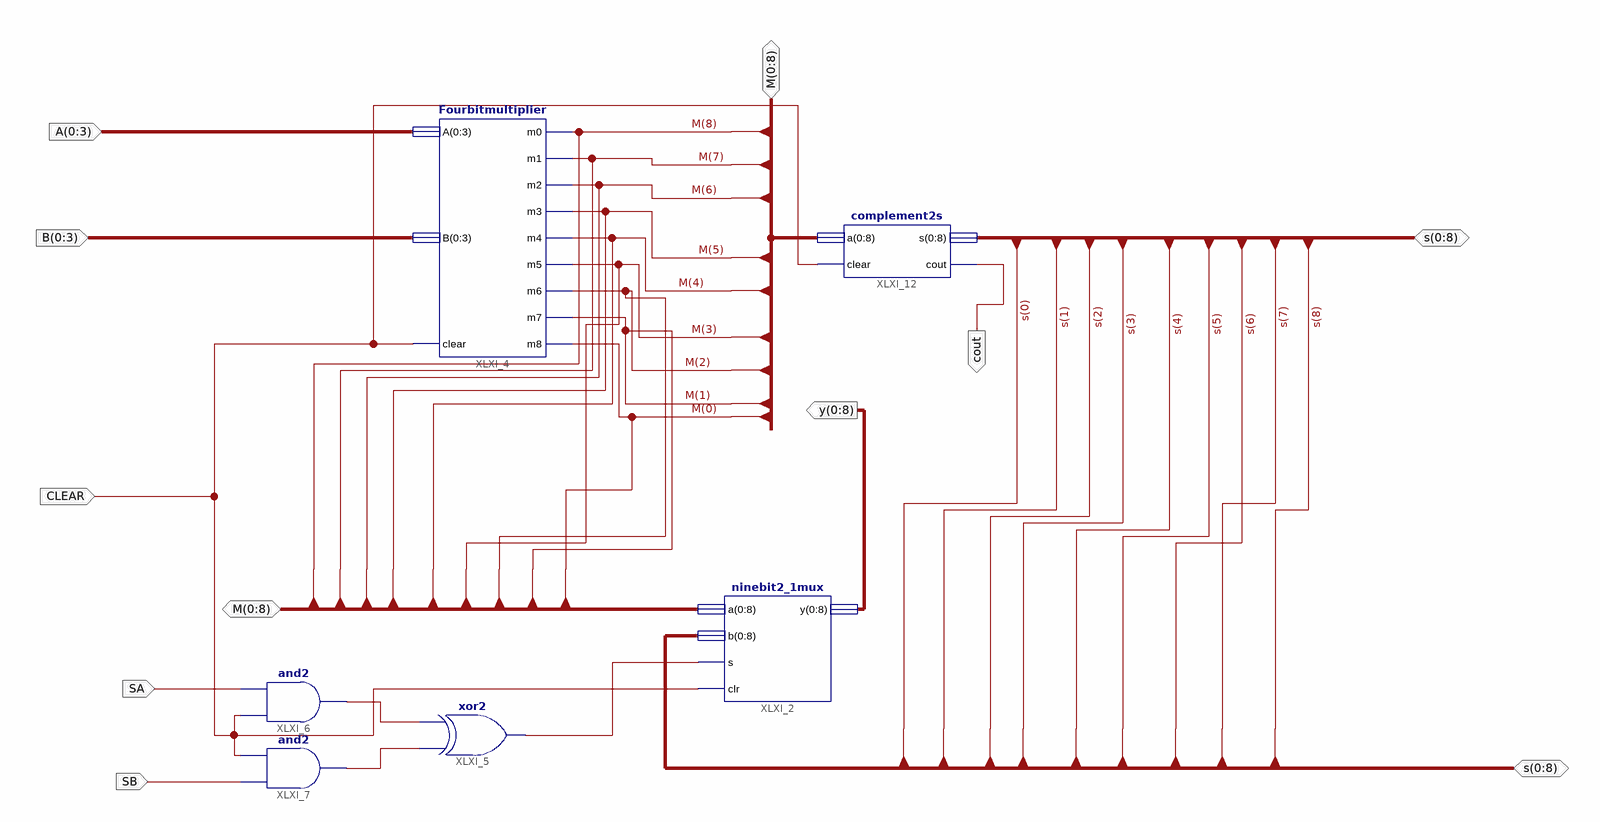
[diagram p0: schematic sheet 1]
// Xilinx ISE schematic signedmultipler.sch (artix7) as structural Verilog: 6 symbols, 9 ports
module signedmultipler (
  input  [0:3] A,
  input  [0:3] B,
  input  CLEAR,
  input  SA,
  input  SB,
  inout  [0:8] M,
  inout  [0:8] s,
  output [0:8] y,
  output cout
);

  wire XLXN_148, XLXN_149, XLXN_153;

  ninebit2_1mux XLXI_2 (.a(M), .b(s), .s(XLXN_153), .clr(CLEAR), .y(y));
  Fourbitmultiplier XLXI_4 (
    .A(A), .B(B), .clear(CLEAR), .m0(M[8]), .m1(M[7]), .m2(M[6]), .m3(M[5]), .m4(M[4]), .m5(M[3]), .m6(M[2]),
    .m7(M[1]), .m8(M[0]));
  xor XLXI_5 (XLXN_153, XLXN_149, XLXN_148);
  and XLXI_6 (XLXN_148, CLEAR, SA);
  and XLXI_7 (XLXN_149, SB, CLEAR);
  complement2s XLXI_12 (.a(M), .clear(CLEAR), .s(s), .cout(cout));
endmodule
